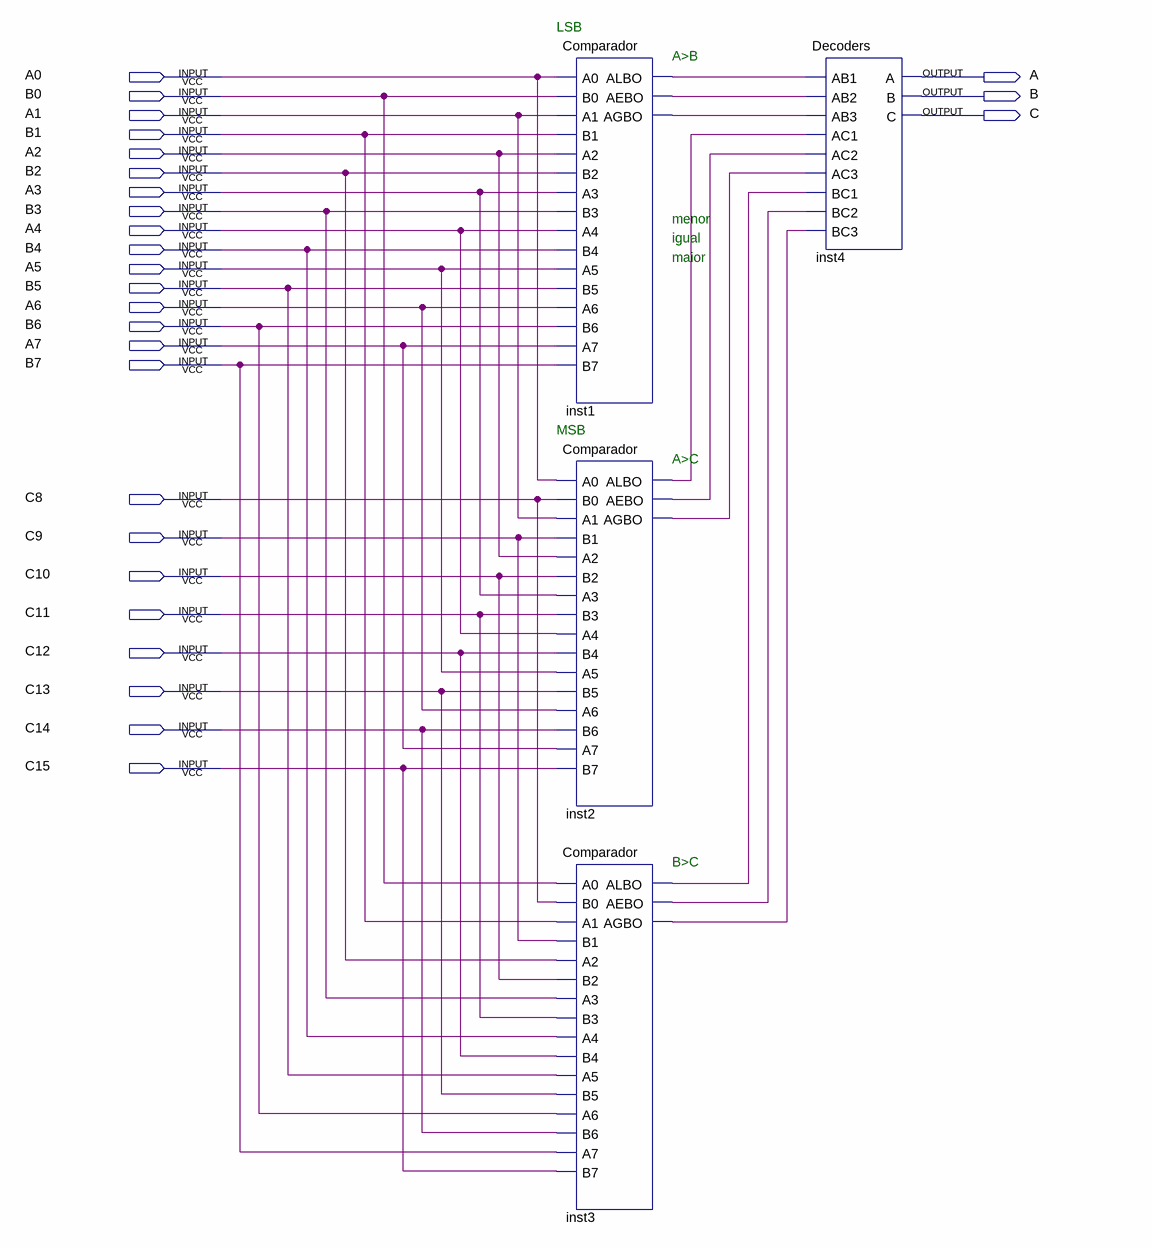
[diagram p0: schematic sheet]
// Quartus schematic ComparadorA.bdf as structural Verilog: 4 symbols, 27 pins
module ComparadorA (
  input  A0,
  input  B0,
  input  A1,
  input  B1,
  input  A2,
  input  B2,
  input  A3,
  input  B3,
  input  A4,
  input  B4,
  input  A5,
  input  B5,
  input  A6,
  input  B6,
  input  A7,
  input  B7,
  input  C8,
  input  C9,
  input  C10,
  input  C11,
  input  C12,
  input  C13,
  input  C14,
  input  C15,
  output A,
  output B,
  output C
);

  wire inst1_aebo, inst1_agbo, inst1_albo, inst2_aebo, inst2_agbo, inst2_albo, inst3_aebo, inst3_agbo,
       inst3_albo;

  Comparador inst1 (
    .A0(A0), .B0(B0), .A1(A1), .B1(B1), .A2(A2), .B2(B2), .A3(A3), .B3(B3), .A4(A4), .B4(B4), .A5(A5),
    .B5(B5), .A6(A6), .B6(B6), .A7(A7), .B7(B7), .ALBO(inst1_albo), .AEBO(inst1_aebo), .AGBO(inst1_agbo));
  Comparador inst2 (
    .A0(A0), .B0(C8), .A1(A1), .B1(C9), .A2(A2), .B2(C10), .A3(A3), .B3(C11), .A4(A4), .B4(C12), .A5(A5),
    .B5(C13), .A6(A6), .B6(C14), .A7(A7), .B7(C15), .ALBO(inst2_albo), .AEBO(inst2_aebo), .AGBO(inst2_agbo));
  Comparador inst3 (
    .A0(B0), .B0(C8), .A1(B1), .B1(C9), .A2(B2), .B2(C10), .A3(B3), .B3(C11), .A4(B4), .B4(C12), .A5(B5),
    .B5(C13), .A6(B6), .B6(C14), .A7(B7), .B7(C15), .ALBO(inst3_albo), .AEBO(inst3_aebo), .AGBO(inst3_agbo));
  Decoders inst4 (
    .AB1(inst1_albo), .AB2(inst1_aebo), .AB3(inst1_agbo), .AC1(inst2_albo), .AC2(inst2_aebo),
    .AC3(inst2_agbo), .BC1(inst3_albo), .BC2(inst3_aebo), .BC3(inst3_agbo), .A(A), .B(B), .C(C));

  // Notes on the sheet:
  //   LSB
  //   A>B
  //   menor
  //   igual
  //   maior
  //   MSB
  //   A>C
  //   B>C
endmodule
